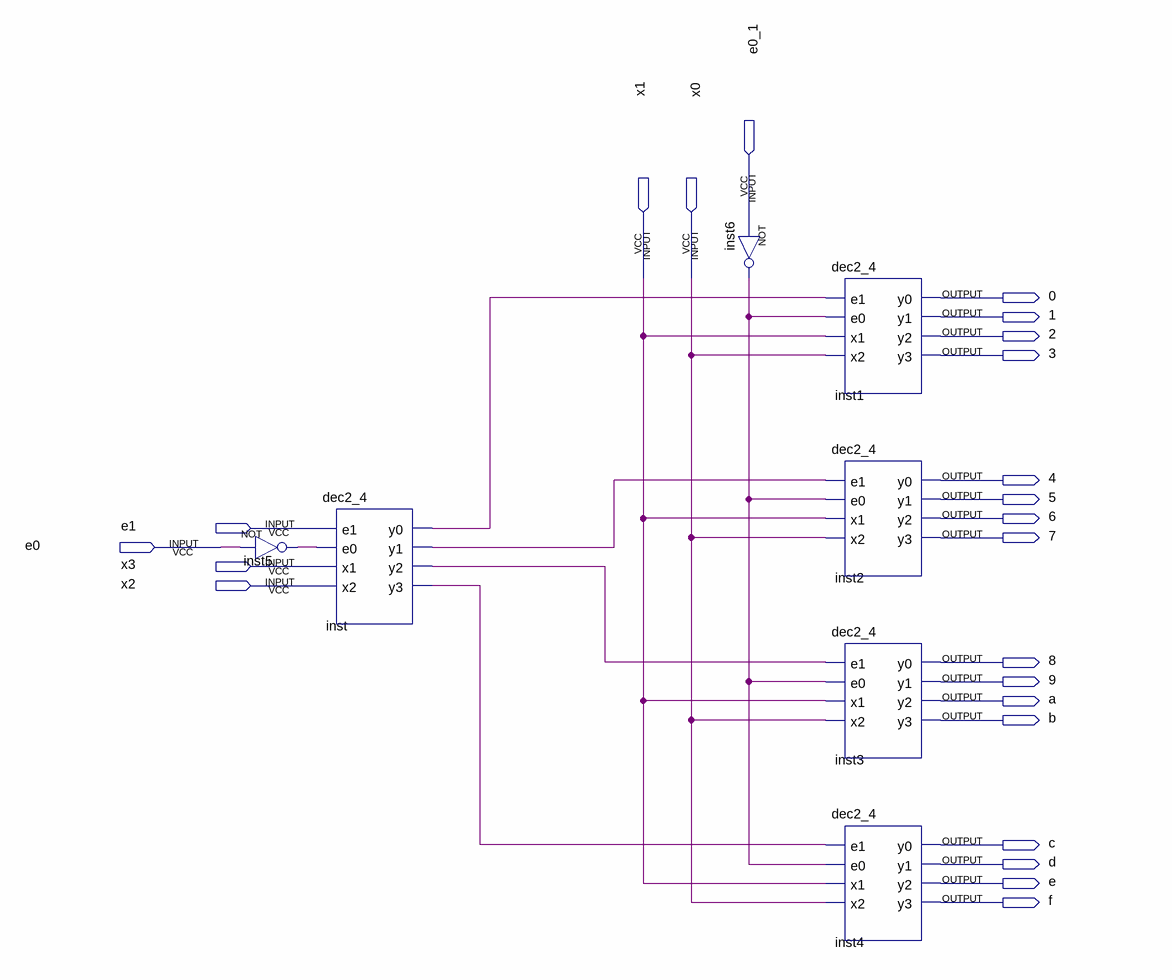
[diagram p0: schematic sheet]
// Quartus schematic 4x16_with2x4.bdf as structural Verilog: 7 symbols, 23 pins
module \4x16_with2x4  (
  input  e0_1,
  input  x1,
  input  x0,
  input  e1,
  input  e0,
  input  x3,
  input  x2,
  output \0 ,
  output \1 ,
  output \2 ,
  output \3 ,
  output \4 ,
  output \5 ,
  output \6 ,
  output \7 ,
  output \8 ,
  output \9 ,
  output a,
  output b,
  output c,
  output d,
  output e,
  output f
);

  wire inst5_out, inst6_out, inst_y0, inst_y1, inst_y2, inst_y3;

  not inst5 (inst5_out, e0);
  dec2_4 inst (.e1(e1), .e0(inst5_out), .x1(x3), .x2(x2), .y0(inst_y0), .y1(inst_y1), .y2(inst_y2), .y3(inst_y3));
  not inst6 (inst6_out, e0_1);
  dec2_4 inst1 (.e1(inst_y0), .e0(inst6_out), .x1(x1), .x2(x0), .y0(\0 ), .y1(\1 ), .y2(\2 ), .y3(\3 ));
  dec2_4 inst2 (.e1(inst_y1), .e0(inst6_out), .x1(x1), .x2(x0), .y0(\4 ), .y1(\5 ), .y2(\6 ), .y3(\7 ));
  dec2_4 inst3 (.e1(inst_y2), .e0(inst6_out), .x1(x1), .x2(x0), .y0(\8 ), .y1(\9 ), .y2(a), .y3(b));
  dec2_4 inst4 (.e1(inst_y3), .e0(inst6_out), .x1(x1), .x2(x0), .y0(c), .y1(d), .y2(e), .y3(f));
endmodule
